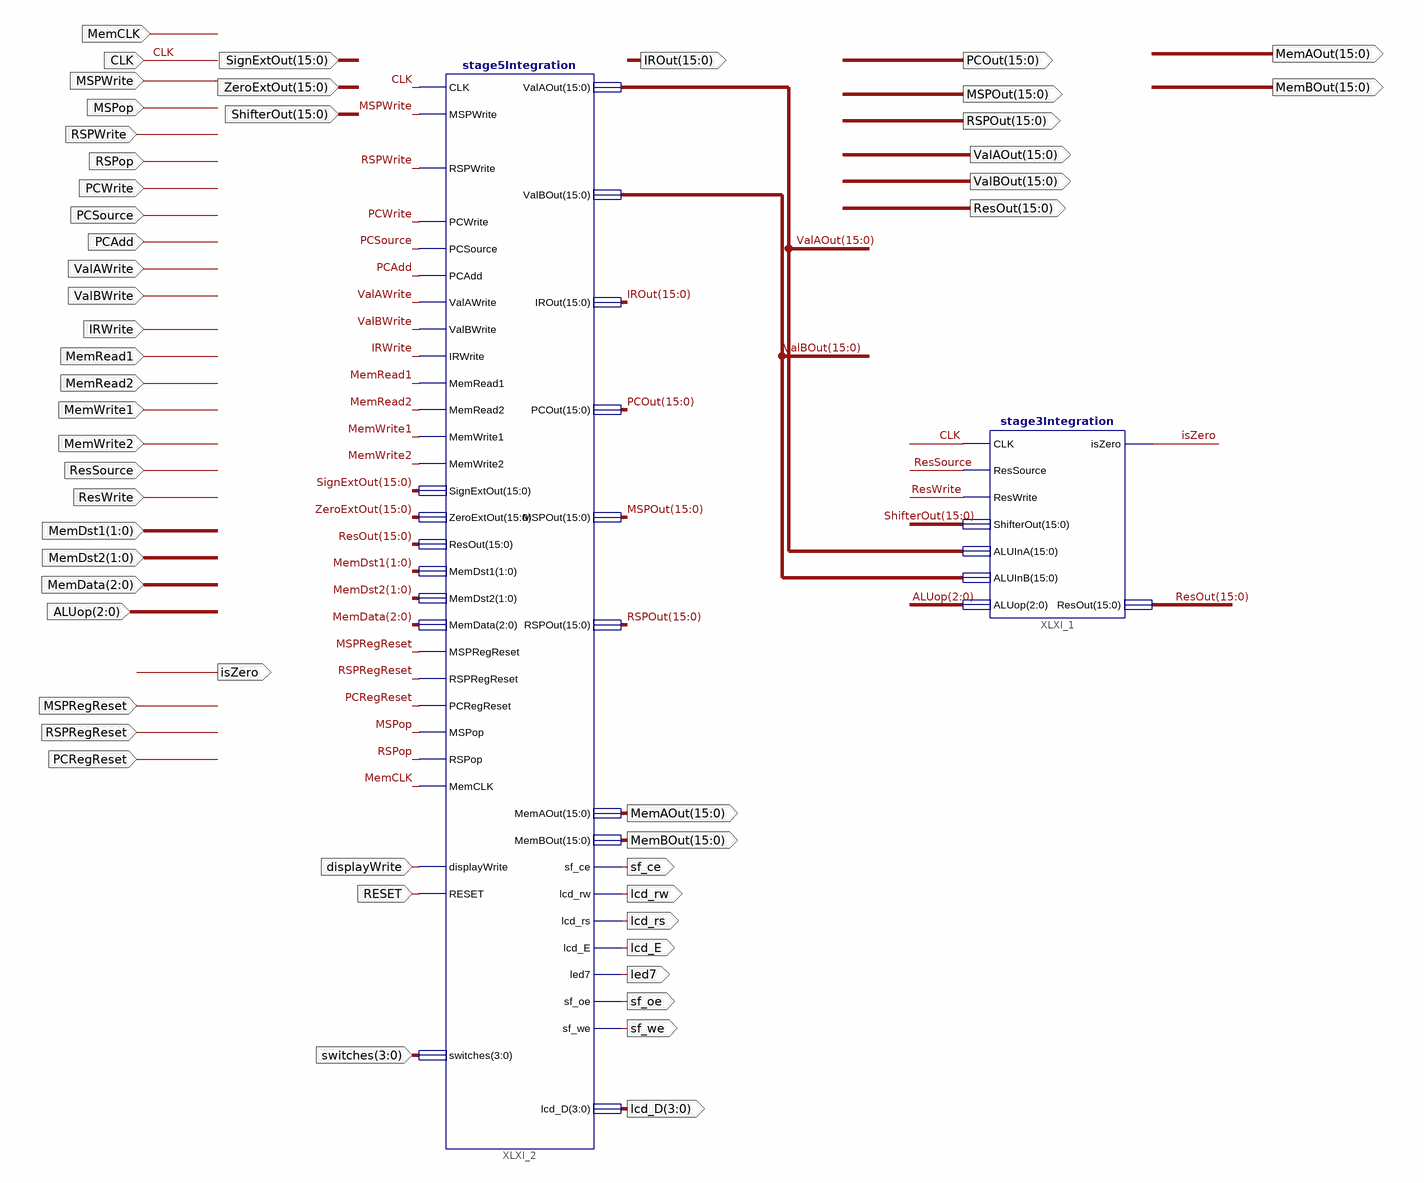
[diagram p0: schematic sheet 1]
// Xilinx ISE schematic stage6BasicOperation.sch (spartan3e) as structural Verilog: 2 symbols, 49 ports
module stage6BasicOperation (
  input  CLK,
  input  MSPWrite,
  input  MSPop,
  input  RSPop,
  input  PCWrite,
  input  PCSource,
  input  PCAdd,
  input  ValAWrite,
  input  ValBWrite,
  input  MemWrite2,
  input  [15:0] SignExtOut,
  input  [15:0] ZeroExtOut,
  input  [1:0] MemDst1,
  input  [15:0] ShifterOut,
  input  IRWrite,
  input  MemRead1,
  input  MemRead2,
  input  MemWrite1,
  input  ResSource,
  input  ResWrite,
  input  [1:0] MemDst2,
  input  MSPRegReset,
  input  RSPRegReset,
  input  PCRegReset,
  input  [2:0] ALUop,
  input  MemCLK,
  input  RSPWrite,
  input  [2:0] MemData,
  input  displayWrite,
  input  RESET,
  input  [3:0] switches,
  output [15:0] ValAOut,
  output [15:0] ValBOut,
  output [15:0] ResOut,
  output [15:0] RSPOut,
  output isZero,
  output [15:0] IROut,
  output [15:0] PCOut,
  output [15:0] MSPOut,
  output [15:0] MemBOut,
  output [15:0] MemAOut,
  output sf_we,
  output sf_oe,
  output led7,
  output lcd_E,
  output lcd_rs,
  output lcd_rw,
  output sf_ce,
  output [3:0] lcd_D
);

  stage3Integration XLXI_1 (
    .CLK(CLK), .ResSource(ResSource), .ResWrite(ResWrite), .ShifterOut(ShifterOut), .ALUInA(ValAOut),
    .ALUInB(ValBOut), .ALUop(ALUop), .isZero(isZero), .ResOut(ResOut));
  stage5Integration XLXI_2 (
    .CLK(CLK), .MemCLK(MemCLK), .MSPWrite(MSPWrite), .MSPop(MSPop), .MSPRegReset(MSPRegReset),
    .RSPWrite(RSPWrite), .RSPop(RSPop), .RSPRegReset(RSPRegReset), .PCWrite(PCWrite), .PCSource(PCSource),
    .PCAdd(PCAdd), .PCRegReset(PCRegReset), .ValAWrite(ValAWrite), .ValBWrite(ValBWrite), .IRWrite(IRWrite),
    .displayWrite(displayWrite), .MemRead1(MemRead1), .MemRead2(MemRead2), .MemWrite1(MemWrite1),
    .MemWrite2(MemWrite2), .RESET(RESET), .SignExtOut(SignExtOut), .ZeroExtOut(ZeroExtOut), .ResOut(ResOut),
    .MemDst1(MemDst1), .MemDst2(MemDst2), .MemData(MemData), .switches(switches), .sf_ce(sf_ce),
    .sf_oe(sf_oe), .sf_we(sf_we), .lcd_rw(lcd_rw), .lcd_rs(lcd_rs), .lcd_E(lcd_E), .led7(led7),
    .ValAOut(ValAOut), .ValBOut(ValBOut), .IROut(IROut), .PCOut(PCOut), .MSPOut(MSPOut), .RSPOut(RSPOut),
    .MemAOut(MemAOut), .MemBOut(MemBOut), .lcd_D(lcd_D));
endmodule
